# Altium project PCB_Project1.PrjPCB
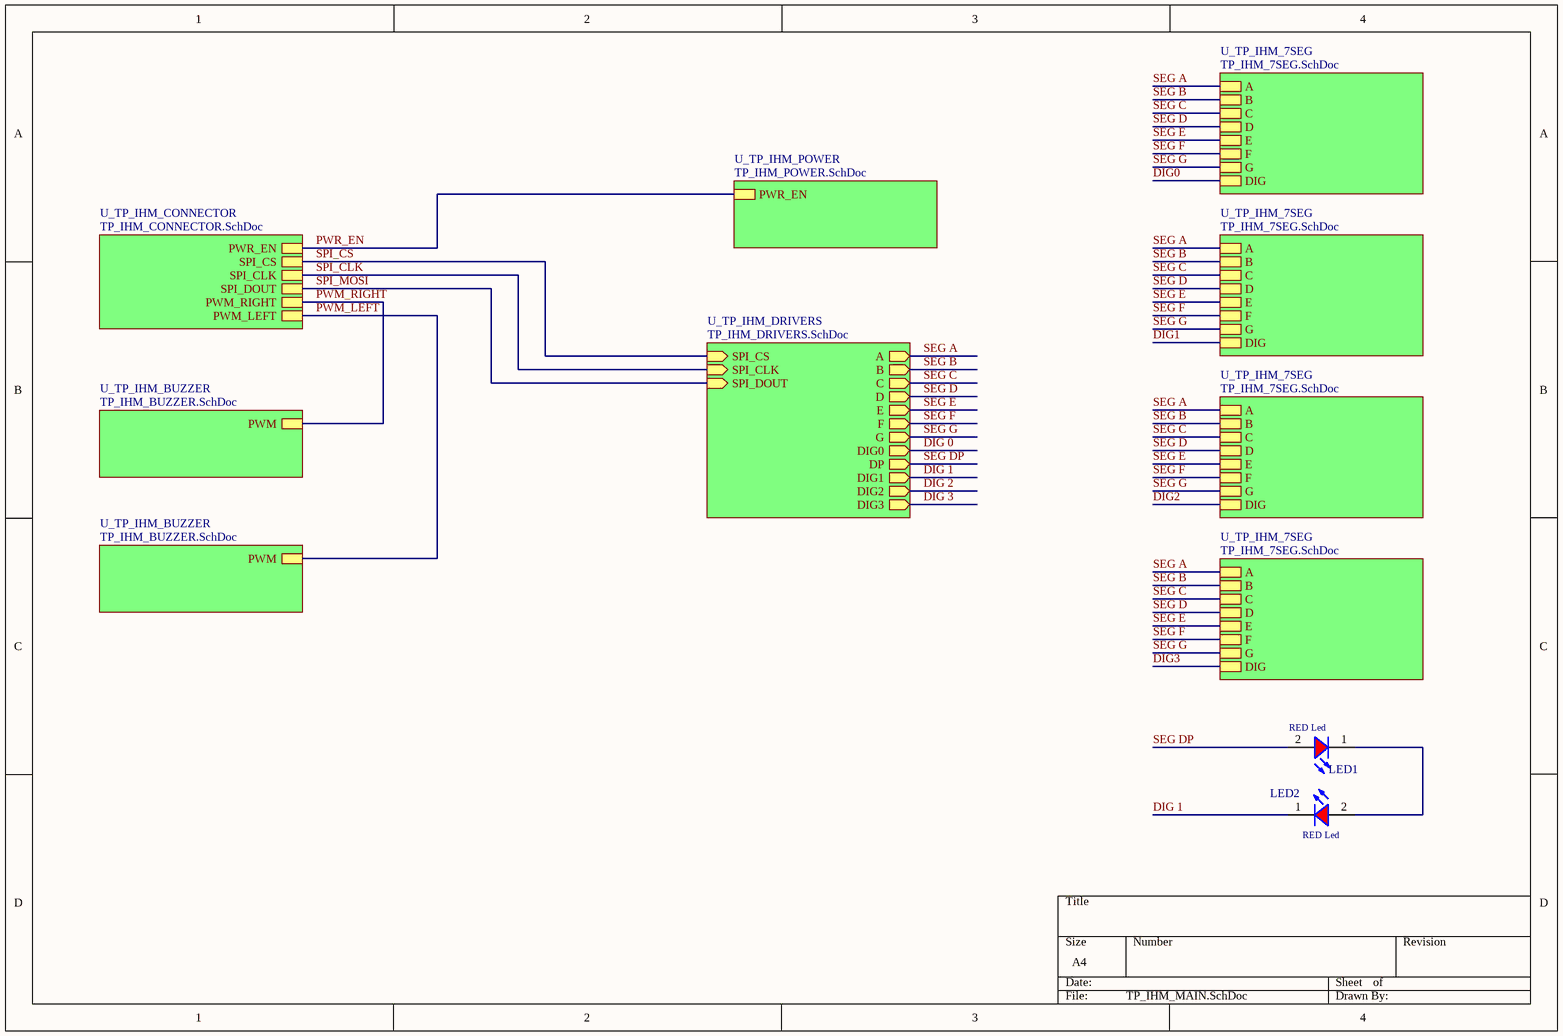
[diagram p0: TP_IHM_MAIN.SchDoc]
6 sheets, 55 parts. Net scope: hierarchical (ports join the sheet entries above them; power ports are global).
Board files: PCB1.PcbDoc, Eurocircuit_6C.PcbDoc
Sheets:
  TP_IHM_MAIN.SchDoc
    U_TP_IHM_7SEG = TP_IHM_7SEG.SchDoc
    U_TP_IHM_BUZZER = TP_IHM_BUZZER.SchDoc
    U_TP_IHM_CONNECTOR = TP_IHM_CONNECTOR.SchDoc
    U_TP_IHM_BUZZER = TP_IHM_BUZZER.SchDoc
    U_TP_IHM_DRIVERS = TP_IHM_DRIVERS.SchDoc
    U_TP_IHM_7SEG = TP_IHM_7SEG.SchDoc
    U_TP_IHM_7SEG = TP_IHM_7SEG.SchDoc
    U_TP_IHM_7SEG = TP_IHM_7SEG.SchDoc
    U_TP_IHM_POWER = TP_IHM_POWER.SchDoc

## Sheet TP_IHM_MAIN.SchDoc
size A4

### Parts
LED1  RED Led  [LED_0603_RED]
LED2  RED Led  [LED_0603_RED]

### Sub-sheets
U_TP_IHM_7SEG = TP_IHM_7SEG.SchDoc: A, B, C, D, E, F, G, DIG
U_TP_IHM_7SEG = TP_IHM_7SEG.SchDoc: A, B, C, D, E, F, G, DIG
U_TP_IHM_7SEG = TP_IHM_7SEG.SchDoc: A, B, C, D, E, F, G, DIG
U_TP_IHM_7SEG = TP_IHM_7SEG.SchDoc: A, B, C, D, E, F, G, DIG
U_TP_IHM_BUZZER = TP_IHM_BUZZER.SchDoc: PWM
U_TP_IHM_BUZZER = TP_IHM_BUZZER.SchDoc: PWM
U_TP_IHM_CONNECTOR = TP_IHM_CONNECTOR.SchDoc: PWR_EN, SPI_CS, SPI_CLK, SPI_DOUT, PWM_RIGHT, PWM_LEFT
U_TP_IHM_DRIVERS = TP_IHM_DRIVERS.SchDoc: SPI_CS (in), SPI_CLK (in), A (out), B (out), C (out), D (out), E (out), F (out), G (out), DIG0 (out), SPI_DOUT (in), DP (out), DIG1 (out), DIG2 (out), DIG3 (out)
U_TP_IHM_POWER = TP_IHM_POWER.SchDoc: PWR_EN

### Nets
DIG 1: LED2.1(K) ; sheet U_TP_IHM_DRIVERS/DIG1
PWM_LEFT: sheet U_TP_IHM_CONNECTOR/PWM_LEFT, sheet U_TP_IHM_BUZZER/PWM
PWM_RIGHT: sheet U_TP_IHM_BUZZER/PWM, sheet U_TP_IHM_CONNECTOR/PWM_RIGHT
PWR_EN: sheet U_TP_IHM_CONNECTOR/PWR_EN, sheet U_TP_IHM_POWER/PWR_EN
SEG A: sheet U_TP_IHM_7SEG/A, sheet U_TP_IHM_DRIVERS/A, sheet U_TP_IHM_7SEG/A, sheet U_TP_IHM_7SEG/A, sheet U_TP_IHM_7SEG/A
SEG B: sheet U_TP_IHM_7SEG/B, sheet U_TP_IHM_DRIVERS/B, sheet U_TP_IHM_7SEG/B, sheet U_TP_IHM_7SEG/B, sheet U_TP_IHM_7SEG/B
SEG C: sheet U_TP_IHM_7SEG/C, sheet U_TP_IHM_DRIVERS/C, sheet U_TP_IHM_7SEG/C, sheet U_TP_IHM_7SEG/C, sheet U_TP_IHM_7SEG/C
SEG D: sheet U_TP_IHM_7SEG/D, sheet U_TP_IHM_DRIVERS/D, sheet U_TP_IHM_7SEG/D, sheet U_TP_IHM_7SEG/D, sheet U_TP_IHM_7SEG/D
SEG DP: LED1.2(A) ; sheet U_TP_IHM_DRIVERS/DP
SEG E: sheet U_TP_IHM_7SEG/E, sheet U_TP_IHM_DRIVERS/E, sheet U_TP_IHM_7SEG/E, sheet U_TP_IHM_7SEG/E, sheet U_TP_IHM_7SEG/E
SEG F: sheet U_TP_IHM_7SEG/F, sheet U_TP_IHM_DRIVERS/F, sheet U_TP_IHM_7SEG/F, sheet U_TP_IHM_7SEG/F, sheet U_TP_IHM_7SEG/F
SEG G: sheet U_TP_IHM_7SEG/G, sheet U_TP_IHM_DRIVERS/G, sheet U_TP_IHM_7SEG/G, sheet U_TP_IHM_7SEG/G, sheet U_TP_IHM_7SEG/G
SPI_CLK: sheet U_TP_IHM_CONNECTOR/SPI_CLK, sheet U_TP_IHM_DRIVERS/SPI_CLK
SPI_CS: sheet U_TP_IHM_CONNECTOR/SPI_CS, sheet U_TP_IHM_DRIVERS/SPI_CS
SPI_MOSI: sheet U_TP_IHM_CONNECTOR/SPI_DOUT, sheet U_TP_IHM_DRIVERS/SPI_DOUT
NetLED1_1: LED1.1(K) LED2.2(A)

### Library data of the parts
LED1 LED2 = LED_RED_SMD_WE_150060RS750x0: LED RED SMD WE 150060RS750x0; ref: 150060RS750x0

## Sheet TP_IHM_7SEG.SchDoc
size A4
Used 4 times, as channels U_TP_IHM_7SEG, U_TP_IHM_7SEG, U_TP_IHM_7SEG, U_TP_IHM_7SEG. Parts and nets are listed once, with the designators drawn on the sheet.
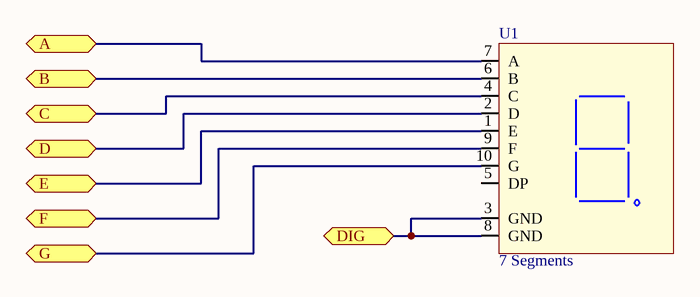
[diagram p1: TP_IHM_7SEG.SchDoc]

### Parts
U1  7 Segments  [SA10-21GWA]

### Ports
A, B, C, D, DIG, E, F, G

### Nets
A: U1.7(A) ; port A
B: U1.6(B) ; port B
C: U1.4(C) ; port C
D: U1.2(D) ; port D
DIG: U1.3(GND) U1.8(GND) ; port DIG
E: U1.1(E) ; port E
F: U1.9(F) ; port F
G: U1.10(G) ; port G

Not connected (* = marked no-connect by the designer): U1 5(DP)

### Channels
U_TP_IHM_7SEG: designators U1=U_4_1; ports A=SEG A B=SEG B C=SEG C D=SEG D DIG=DIG0 E=SEG E F=SEG F G=SEG G
U_TP_IHM_7SEG: designators U1=U_3_1; ports A=SEG A B=SEG B C=SEG C D=SEG D DIG=DIG1 E=SEG E F=SEG F G=SEG G
U_TP_IHM_7SEG: designators U1=U_2_1; ports A=SEG A B=SEG B C=SEG C D=SEG D DIG=DIG2 E=SEG E F=SEG F G=SEG G
U_TP_IHM_7SEG: designators U1=U_1_1; ports A=SEG A B=SEG B C=SEG C D=SEG D DIG=DIG3 E=SEG E F=SEG F G=SEG G

### Library data of the parts
U1 = SC10-21SRWA: KingBright Led 7 Segments; Reference: SC10-21SRWA

## Sheet TP_IHM_BUZZER.SchDoc
size A4
Used 2 times, as channels U_TP_IHM_BUZZER, U_TP_IHM_BUZZER. Parts and nets are listed once, with the designators drawn on the sheet.
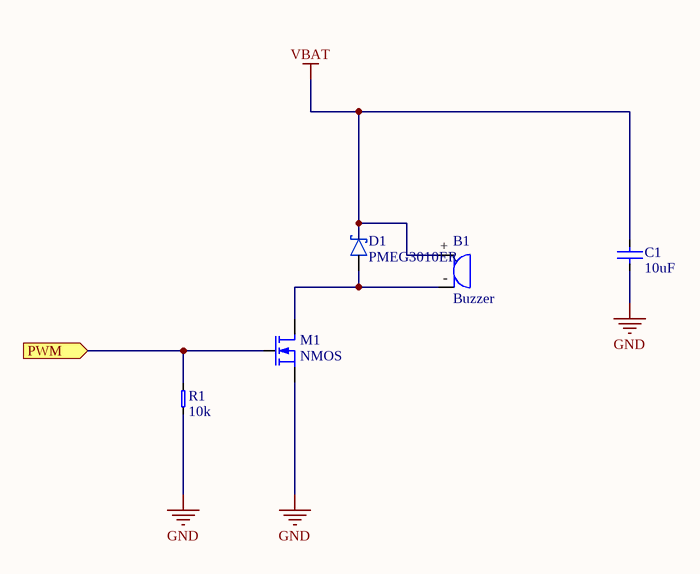
[diagram p2: TP_IHM_BUZZER.SchDoc]

### Parts
B1  Buzzer  [SD160709]
C1  value 10uF  [0603_CAP_LD]  (hidden comment: CerCap)
D1  PMEG3010ER  [SOD123W]
M1  NMOS  [MOSFET-SOT23]
R1  value 10k  [0603_RES_LD]  (hidden comment: Resistor)

### Ports
PWM (in)

### Nets
GND: C1.1 M1.S R1.1
VBAT: B1.+ C1.2 D1.K
PWM: M1.G R1.2 ; port PWM
NetB1_-: B1.- D1.A M1.D

### Channels
U_TP_IHM_BUZZER: designators B1=B_2_1 C1=C_2_1 D1=D_2_1 M1=M_2_1 R1=R_2_1; ports PWM=PWM_RIGHT
U_TP_IHM_BUZZER: designators B1=B_1_1 C1=C_1_1 D1=D_1_1 M1=M_1_1 R1=R_1_1; ports PWM=PWM_LEFT

### Library data of the parts
B1 = SD160709: TDK SD160709 Buzzer; Reference: SD160709
C1 = CerCap: Ceramic Capacitor; Type: *; Voltage/Power: *; Package: *
D1 = Schottky_PMEG3010ER: Nexperia 1A low Vf Mega Schottky barrier rectifier; Reference: PMEG3010ER
M1 = N-MOSFET: N MOSFET
R1 = Resistor: Precision: *; Package: *

## Sheet TP_IHM_CONNECTOR.SchDoc
size A4
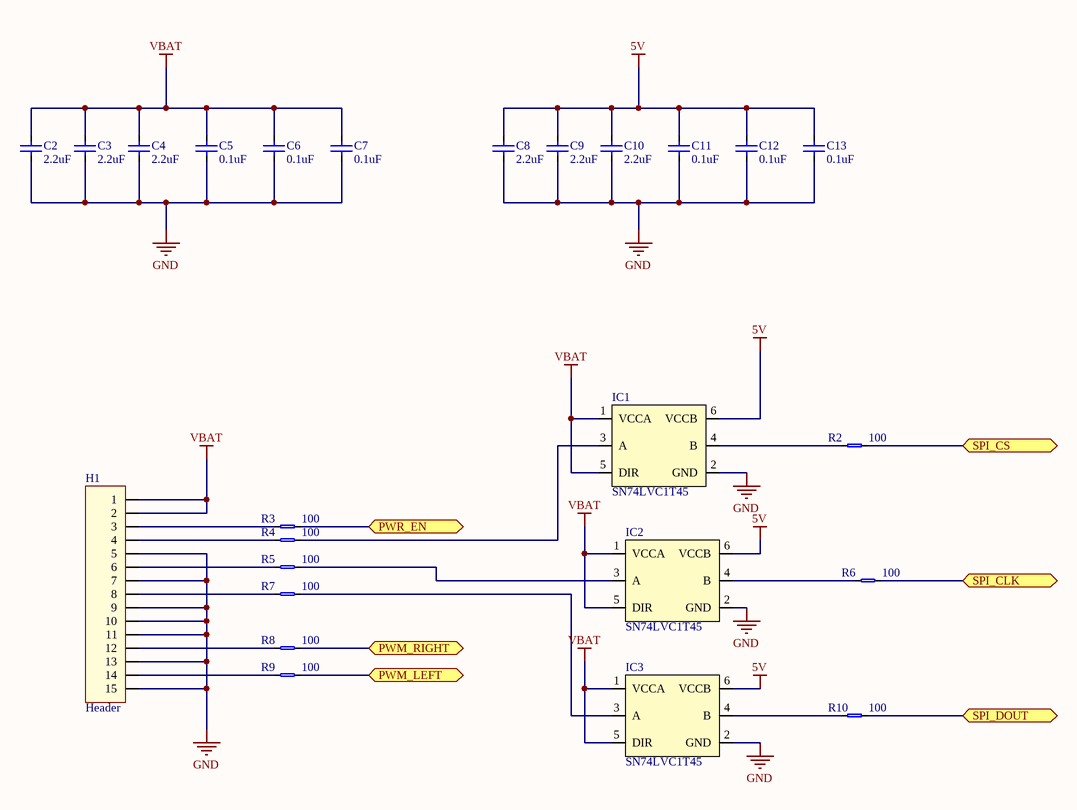
[diagram p3: TP_IHM_CONNECTOR.SchDoc]

### Parts
C2  value 2.2uF  [0402_CAP_LD]  (hidden comment: CerCap)
C3  value 2.2uF  [0402_CAP_LD]  (hidden comment: CerCap)
C4  value 2.2uF  [0402_CAP_LD]  (hidden comment: CerCap)
C5  value 0.1uF  [0402_CAP_LD]  (hidden comment: CerCap)
C6  value 0.1uF  [0402_CAP_LD]  (hidden comment: CerCap)
C7  value 0.1uF  [0402_CAP_LD]  (hidden comment: CerCap)
C8  value 2.2uF  [0402_CAP_LD]  (hidden comment: CerCap)
C9  value 2.2uF  [0402_CAP_LD]  (hidden comment: CerCap)
C10  value 2.2uF  [0402_CAP_LD]  (hidden comment: CerCap)
C11  value 0.1uF  [0402_CAP_LD]  (hidden comment: CerCap)
C12  value 0.1uF  [0402_CAP_LD]  (hidden comment: CerCap)
C13  value 0.1uF  [0402_CAP_LD]  (hidden comment: CerCap)
H1  Header  [653115131822]
IC1  SN74LVC1T45  [MO-203AB_LD]
IC2  SN74LVC1T45  [MO-203AB_LD]
IC3  SN74LVC1T45  [MO-203AB_LD]
R2  value 100  [0603_RES_LD]  (hidden comment: Resistor)
R3  value 100  [0603_RES_LD]  (hidden comment: Resistor)
R4  value 100  [0603_RES_LD]  (hidden comment: Resistor)
R5  value 100  [0603_RES_LD]  (hidden comment: Resistor)
R6  value 100  [0603_RES_LD]  (hidden comment: Resistor)
R7  value 100  [0603_RES_LD]  (hidden comment: Resistor)
R8  value 100  [0603_RES_LD]  (hidden comment: Resistor)
R9  value 100  [0603_RES_LD]  (hidden comment: Resistor)
R10  value 100  [0603_RES_LD]  (hidden comment: Resistor)

### Ports
PWM_LEFT, PWM_RIGHT, PWR_EN, SPI_CLK, SPI_CS, SPI_DOUT

### Nets
5V: C8.2 C9.2 C10.2 C11.2 C12.2 C13.2 IC1.6(VCCB) IC2.6(VCCB) IC3.6(VCCB)
GND: C2.1 C3.1 C4.1 C5.1 C6.1 C7.1 C8.1 C9.1 C10.1 C11.1 C12.1 C13.1 H1.5 H1.7 H1.9 H1.10 H1.11 H1.13 H1.15 IC1.2(GND) IC2.2(GND) IC3.2(GND)
VBAT: C2.2 C3.2 C4.2 C5.2 C6.2 C7.2 H1.1 H1.2 IC1.1(VCCA) IC1.5(DIR) IC2.1(VCCA) IC2.5(DIR) IC3.1(VCCA) IC3.5(DIR)
PWM_LEFT: R9.2 ; port PWM_LEFT
PWM_RIGHT: R8.2 ; port PWM_RIGHT
PWR_EN: R3.2 ; port PWR_EN
SPI_CLK: R6.2 ; port SPI_CLK
SPI_CS: R2.2 ; port SPI_CS
SPI_MOSI: R10.2 ; port SPI_DOUT
NetH1_3: H1.3 R3.1
NetH1_4: H1.4 R4.1
NetH1_6: H1.6 R5.1
NetH1_8: H1.8 R7.1
NetH1_12: H1.12 R8.1
NetH1_14: H1.14 R9.1
NetIC1_3: IC1.3(A) R4.2
NetIC1_4: IC1.4(B) R2.1
NetIC2_3: IC2.3(A) R5.2
NetIC2_4: IC2.4(B) R6.1
NetIC3_3: IC3.3(A) R7.2
NetIC3_4: IC3.4(B) R10.1

### Library data of the parts
C2-C13 = CerCap: Ceramic Capacitor; Type: *; Voltage/Power: *; Package: *
H1 = HEADER_15x1: Header 15x1
IC1-IC3 = SN74LVC1T45: Single Bit Dual Supply Buffer
R2-R10 = Resistor: Precision: *; Package: *

## Sheet TP_IHM_DRIVERS.SchDoc
size A4
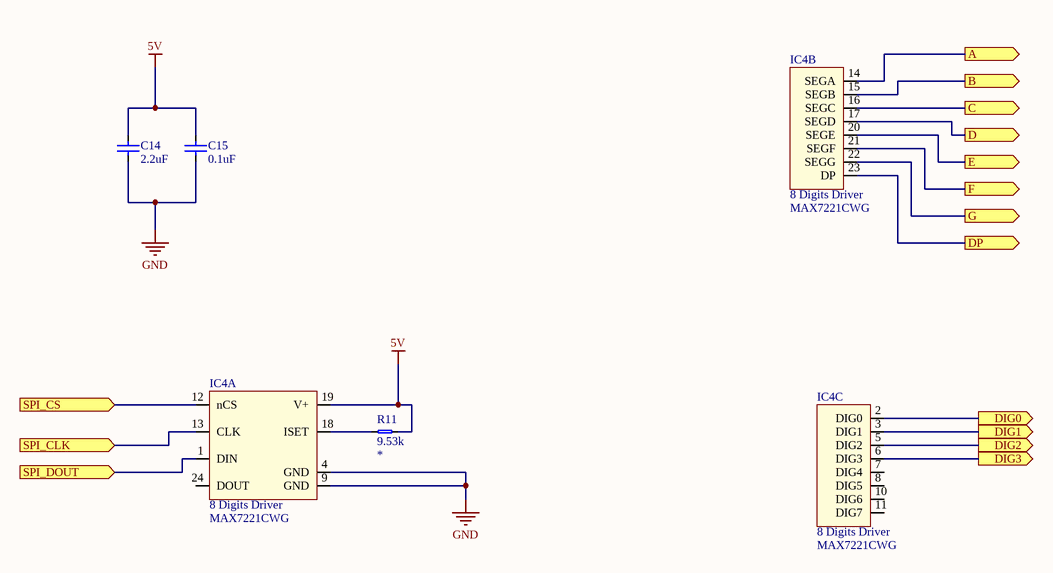
[diagram p4: TP_IHM_DRIVERS.SchDoc]

### Parts
C14  value 2.2uF  [0402_CAP_LD]  (hidden comment: CerCap)
C15  value 0.1uF  [0402_CAP_LD]  (hidden comment: CerCap)
IC4  8 Digits Driver  [MAX7221CWG]  (parts A,B,C of 3)
R11  value 9.53k  [0603_RES_LD]  (hidden comment: Resistor)

### Ports
A (out), B (out), C (out), D (out), DIG0 (out), DIG1 (out), DIG2 (out), DIG3 (out), DP (out), E (out), F (out), G (out), SPI_CLK (in), SPI_CS (in), SPI_DOUT (in)

### Nets
5V: C14.2 C15.2 IC4.19(V+) R11.2
GND: C14.1 C15.1 IC4.4(GND) IC4.9(GND)
DIG 0: IC4.2(DIG0) ; port DIG0
DIG 1: IC4.3(DIG1) ; port DIG1
DIG 2: IC4.5(DIG2) ; port DIG2
DIG 3: IC4.6(DIG3) ; port DIG3
SEG A: IC4.14(SEGA) ; port A
SEG B: IC4.15(SEGB) ; port B
SEG C: IC4.16(SEGC) ; port C
SEG D: IC4.17(SEGD) ; port D
SEG DP: IC4.23(DP) ; port DP
SEG E: IC4.20(SEGE) ; port E
SEG F: IC4.21(SEGF) ; port F
SEG G: IC4.22(SEGG) ; port G
SPI_CLK: IC4.13(CLK) ; port SPI_CLK
SPI_CS: IC4.12(nCS) ; port SPI_CS
SPI_MOSI: IC4.1(DIN) ; port SPI_DOUT
NetIC4_18: IC4.18(ISET) R11.1

Not connected (* = marked no-connect by the designer): IC4 7(DIG4) 8(DIG5) 10(DIG6) 11(DIG7) 24(DOUT)

### Library data of the parts
C14 C15 = CerCap: Ceramic Capacitor; Type: *; Voltage/Power: *; Package: *
IC4 = MAX7221: MAX7221 8 Digit 7 Segments Display; Reference: MAX7221CWG
R11 = Resistor: Precision: *; Package: *

## Sheet TP_IHM_POWER.SchDoc
size A4
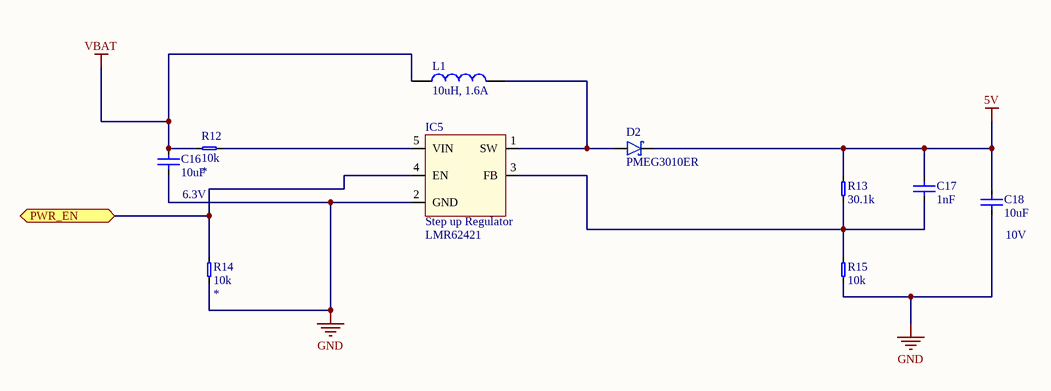
[diagram p5: TP_IHM_POWER.SchDoc]

### Parts
C16  value 10uF  Voltage/Power: 6.3V  [0402_CAP_LD]  (hidden comment: CerCap)
C17  value 1nF  [0402_CAP_LD]  (hidden comment: CerCap)
C18  value 10uF  Voltage/Power: 10V  [0402_CAP_LD]  (hidden comment: CerCap)
D2  PMEG3010ER  [SOD123W]
IC5  Step up Regulator  [LMR62421]
L1  10uH, 1.6A  [INDUCTOR_WE-LQS_5020]
R12  value 10k  [0603_RES_LD]  (hidden comment: Resistor)
R13  value 30.1k  [0603_RES_LD]  (hidden comment: Resistor)
R14  value 10k  [0603_RES_LD]  (hidden comment: Resistor)
R15  value 10k  [0603_RES_LD]  (hidden comment: Resistor)

### Ports
PWR_EN

### Nets
5V: C17.2 C18.2 D2.K R13.2
GND: C16.1 C18.1 IC5.2(GND) R14.1 R15.1
VBAT: C16.2 L1.1 R12.1
PWR_EN: IC5.4(EN) R14.2 ; port PWR_EN
NetC17_1: C17.1 IC5.3(FB) R13.1 R15.2
NetD2_A: D2.A IC5.1(SW) L1.2
NetIC5_5: IC5.5(VIN) R12.2

### Library data of the parts
C16-C18 = CerCap: Ceramic Capacitor; Type: *; Package: *
  C17: Voltage/Power: *
D2 = Schottky_PMEG3010ER: as D1 on sheet TP_IHM_BUZZER; Reference: PMEG3010ER
IC5 = LMR62421XMF: LMR62421 simple switcher 24 Vout stepup voltage SOT-23; Reference: LMR62421
L1 = INDUCTOR_74404052100: WE-LQS SMD Power Inductor, size 5020, 10uH, 1.6A; DC Resistance: 109mOhm; Inductance Tolerance: +/-20%; Saturation Current: 1.95A; Self Resonant Frequency: 37MHz; ComponentLink1Description: Manufacturer; ComponentLink1URL: http://www.we-online.de; ComponentLink2Description: Datasheet; ComponentLink2URL: https://katalog.we-online.com/pbs/datasheet/74404052100.pdf; Part Number: 74404052100; Published Date: May 2019; Publisher: Wurth Elektronik; Rated Current: 1.6A; Inductance: 10uH; Operating Temperature: -40 to +125degC; Mounting Technology: SMT; Packaging: Tape and Reel; DC Resistance Tolerance: +/-20%; Size: 5020; Reference: 74404052100
R12-R15 = Resistor: Precision: *; Package: *

## Nets that join several sheets
5V: TP_IHM_CONNECTOR (9 pins), TP_IHM_DRIVERS (C14.2 C15.2 IC4.19 R11.2), TP_IHM_POWER (C17.2 C18.2 D2.K R13.2)
GND: U_TP_IHM_BUZZER (C_2_1.1 M_2_1.S R_2_1.1), TP_IHM_CONNECTOR (22 pins), U_TP_IHM_BUZZER (C_1_1.1 M_1_1.S R_1_1.1), TP_IHM_DRIVERS (C14.1 C15.1 IC4.4 IC4.9), TP_IHM_POWER (5 pins)
VBAT: U_TP_IHM_BUZZER (B_2_1.+ C_2_1.2 D_2_1.K), TP_IHM_CONNECTOR (14 pins), U_TP_IHM_BUZZER (B_1_1.+ C_1_1.2 D_1_1.K), TP_IHM_POWER (C16.2 L1.1 R12.1)
DIG 1: TP_IHM_MAIN (LED2.1), TP_IHM_DRIVERS (IC4.3)
PWM_LEFT: TP_IHM_CONNECTOR (R9.2), U_TP_IHM_BUZZER (M_1_1.G R_1_1.2)
PWM_RIGHT: U_TP_IHM_BUZZER (M_2_1.G R_2_1.2), TP_IHM_CONNECTOR (R8.2)
PWR_EN: TP_IHM_CONNECTOR (R3.2), TP_IHM_POWER (IC5.4 R14.2)
SEG A: U_TP_IHM_7SEG (U_4_1.7), TP_IHM_DRIVERS (IC4.14), U_TP_IHM_7SEG (U_3_1.7), U_TP_IHM_7SEG (U_2_1.7), U_TP_IHM_7SEG (U_1_1.7)
SEG B: U_TP_IHM_7SEG (U_4_1.6), TP_IHM_DRIVERS (IC4.15), U_TP_IHM_7SEG (U_3_1.6), U_TP_IHM_7SEG (U_2_1.6), U_TP_IHM_7SEG (U_1_1.6)
SEG C: U_TP_IHM_7SEG (U_4_1.4), TP_IHM_DRIVERS (IC4.16), U_TP_IHM_7SEG (U_3_1.4), U_TP_IHM_7SEG (U_2_1.4), U_TP_IHM_7SEG (U_1_1.4)
SEG D: U_TP_IHM_7SEG (U_4_1.2), TP_IHM_DRIVERS (IC4.17), U_TP_IHM_7SEG (U_3_1.2), U_TP_IHM_7SEG (U_2_1.2), U_TP_IHM_7SEG (U_1_1.2)
SEG DP: TP_IHM_MAIN (LED1.2), TP_IHM_DRIVERS (IC4.23)
SEG E: U_TP_IHM_7SEG (U_4_1.1), TP_IHM_DRIVERS (IC4.20), U_TP_IHM_7SEG (U_3_1.1), U_TP_IHM_7SEG (U_2_1.1), U_TP_IHM_7SEG (U_1_1.1)
SEG F: U_TP_IHM_7SEG (U_4_1.9), TP_IHM_DRIVERS (IC4.21), U_TP_IHM_7SEG (U_3_1.9), U_TP_IHM_7SEG (U_2_1.9), U_TP_IHM_7SEG (U_1_1.9)
SEG G: U_TP_IHM_7SEG (U_4_1.10), TP_IHM_DRIVERS (IC4.22), U_TP_IHM_7SEG (U_3_1.10), U_TP_IHM_7SEG (U_2_1.10), U_TP_IHM_7SEG (U_1_1.10)
SPI_CLK: TP_IHM_CONNECTOR (R6.2), TP_IHM_DRIVERS (IC4.13)
SPI_CS: TP_IHM_CONNECTOR (R2.2), TP_IHM_DRIVERS (IC4.12)
SPI_MOSI: TP_IHM_CONNECTOR (R10.2), TP_IHM_DRIVERS (IC4.1)